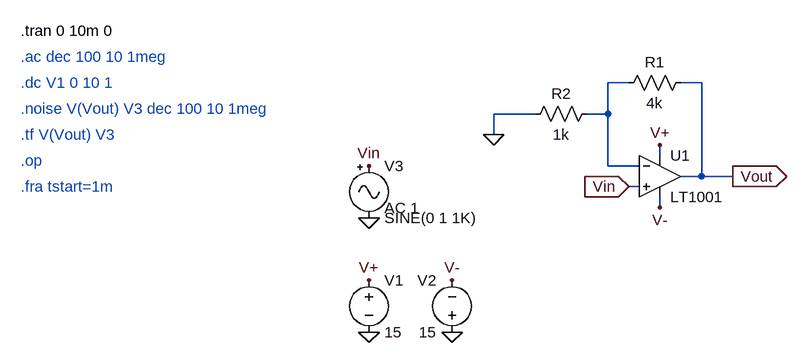
[diagram p0: schematic Todas las simulaciones.asc]
Todas las simulaciones.asc, the LTspice schematic file:
Version 4
SHEET 1 928 680
WIRE 624 -384 592 -384
WIRE 736 -384 704 -384
WIRE 480 -336 416 -336
WIRE 592 -336 592 -384
WIRE 592 -336 560 -336
WIRE 416 -304 416 -336
WIRE 672 -272 672 -288
WIRE 592 -256 592 -336
WIRE 640 -256 592 -256
WIRE 736 -240 736 -384
WIRE 736 -240 704 -240
WIRE 784 -240 736 -240
WIRE 640 -224 624 -224
WIRE 672 -192 672 -208
FLAG 224 0 0
FLAG 352 0 0
FLAG 224 -80 V+
FLAG 352 -80 V-
FLAG 672 -288 V+
FLAG 672 -192 V-
FLAG 224 -176 0
FLAG 224 -256 Vin
FLAG 624 -224 Vin
IOPIN 624 -224 In
FLAG 416 -304 0
FLAG 784 -240 Vout
IOPIN 784 -240 Out
SYMBOL voltage 224 -96 R0
WINDOW 123 0 0 Left 0
WINDOW 39 0 0 Left 0
SYMATTR InstName V1
SYMATTR Value 15
SYMBOL voltage 352 16 R180
WINDOW 0 24 96 Left 2
WINDOW 3 24 16 Left 2
WINDOW 123 0 0 Left 0
WINDOW 39 0 0 Left 0
SYMATTR InstName V2
SYMATTR Value 15
SYMBOL OpAmps\\LT1001 672 -304 R0
SYMATTR InstName U1
SYMBOL Misc\\signal 224 -272 R0
WINDOW 123 24 81 Left 2
WINDOW 39 0 0 Left 0
SYMATTR InstName V3
SYMATTR Value2 AC 1
SYMBOL res 720 -400 R90
WINDOW 0 0 56 VBottom 2
WINDOW 3 32 56 VTop 2
SYMATTR InstName R1
SYMATTR Value 4k
SYMBOL res 576 -352 R90
WINDOW 0 0 56 VBottom 2
WINDOW 3 32 56 VTop 2
SYMATTR InstName R2
SYMATTR Value 1k
TEXT -312 -464 Left 2 !.tran 0 10m 0
TEXT -312 -424 Left 2 ;.ac dec 100 10 1meg
TEXT -312 -384 Left 2 ;.dc V1 0 10 1
TEXT -312 -344 Left 2 ;.noise V(Vout) V3 dec 100 10 1meg
TEXT -312 -304 Left 2 ;.tf V(Vout) V3
TEXT -312 -264 Left 2 ;.op
TEXT -312 -224 Left 2 ;.fra tstart=1m

The netlist it stands for:
* Todas las simulaciones.asc
V1 V+ 0 15
V2 0 V- 15
XU1 Vin N001 V+ V- Vout LT1001  ; pins In+ In- V+ V- OUT
V3 Vin 0 SINE(0 1 1K) AC 1
R1 Vout N001 4k
R2 N001 0 1k
.tran 0 10m 0
* .ac dec 100 10 1meg
* .dc V1 0 10 1
* .noise V(Vout) V3 dec 100 10 1meg
* .tf V(Vout) V3
* .op
* .fra tstart=1m
.lib LTC.lib
.backanno
.end

* Results of the author's LTspice run, read from the files saved beside the schematic
* Operating Point, zero values left out:
*   V(v+) = 15 V
*   V(v-) = -15 V
*   I(V1) = -2.25 mA
*   I(V2) = -2.25 mA
*   Ix(u1:3) = 2.25 mA
*   Ix(u1:4) = -2.25 mA
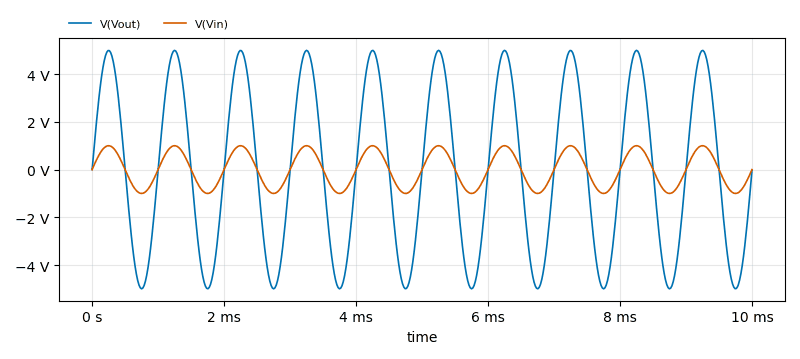
[diagram p1: Transient Analysis of Todas las simulaciones.asc, plotted from the saved traces]
* Transient Analysis, 1 run:
*   V(Vout): min -4.995 V, max 4.995 V, average -1.048 µV, rms 3.532 V, last -29.65 mV
*   V(Vin): min -1 V, max 1 V, average -784.1 nV, rms 707.1 mV, last 0 V